# EasyEDA Pro project ProPrj_STM32F407核心板M.2_Vel1.0.epro, schematic Schematic1
Board Name: Board1; Create Date: 2025-01-26; Page Name: P1; Project Name: STM32F407核心板M.2; Schematic Name: Schematic1; Update Date: 2025-02-14; Company: 嘉立创EDA; Page Size: A4; Version: V1.0
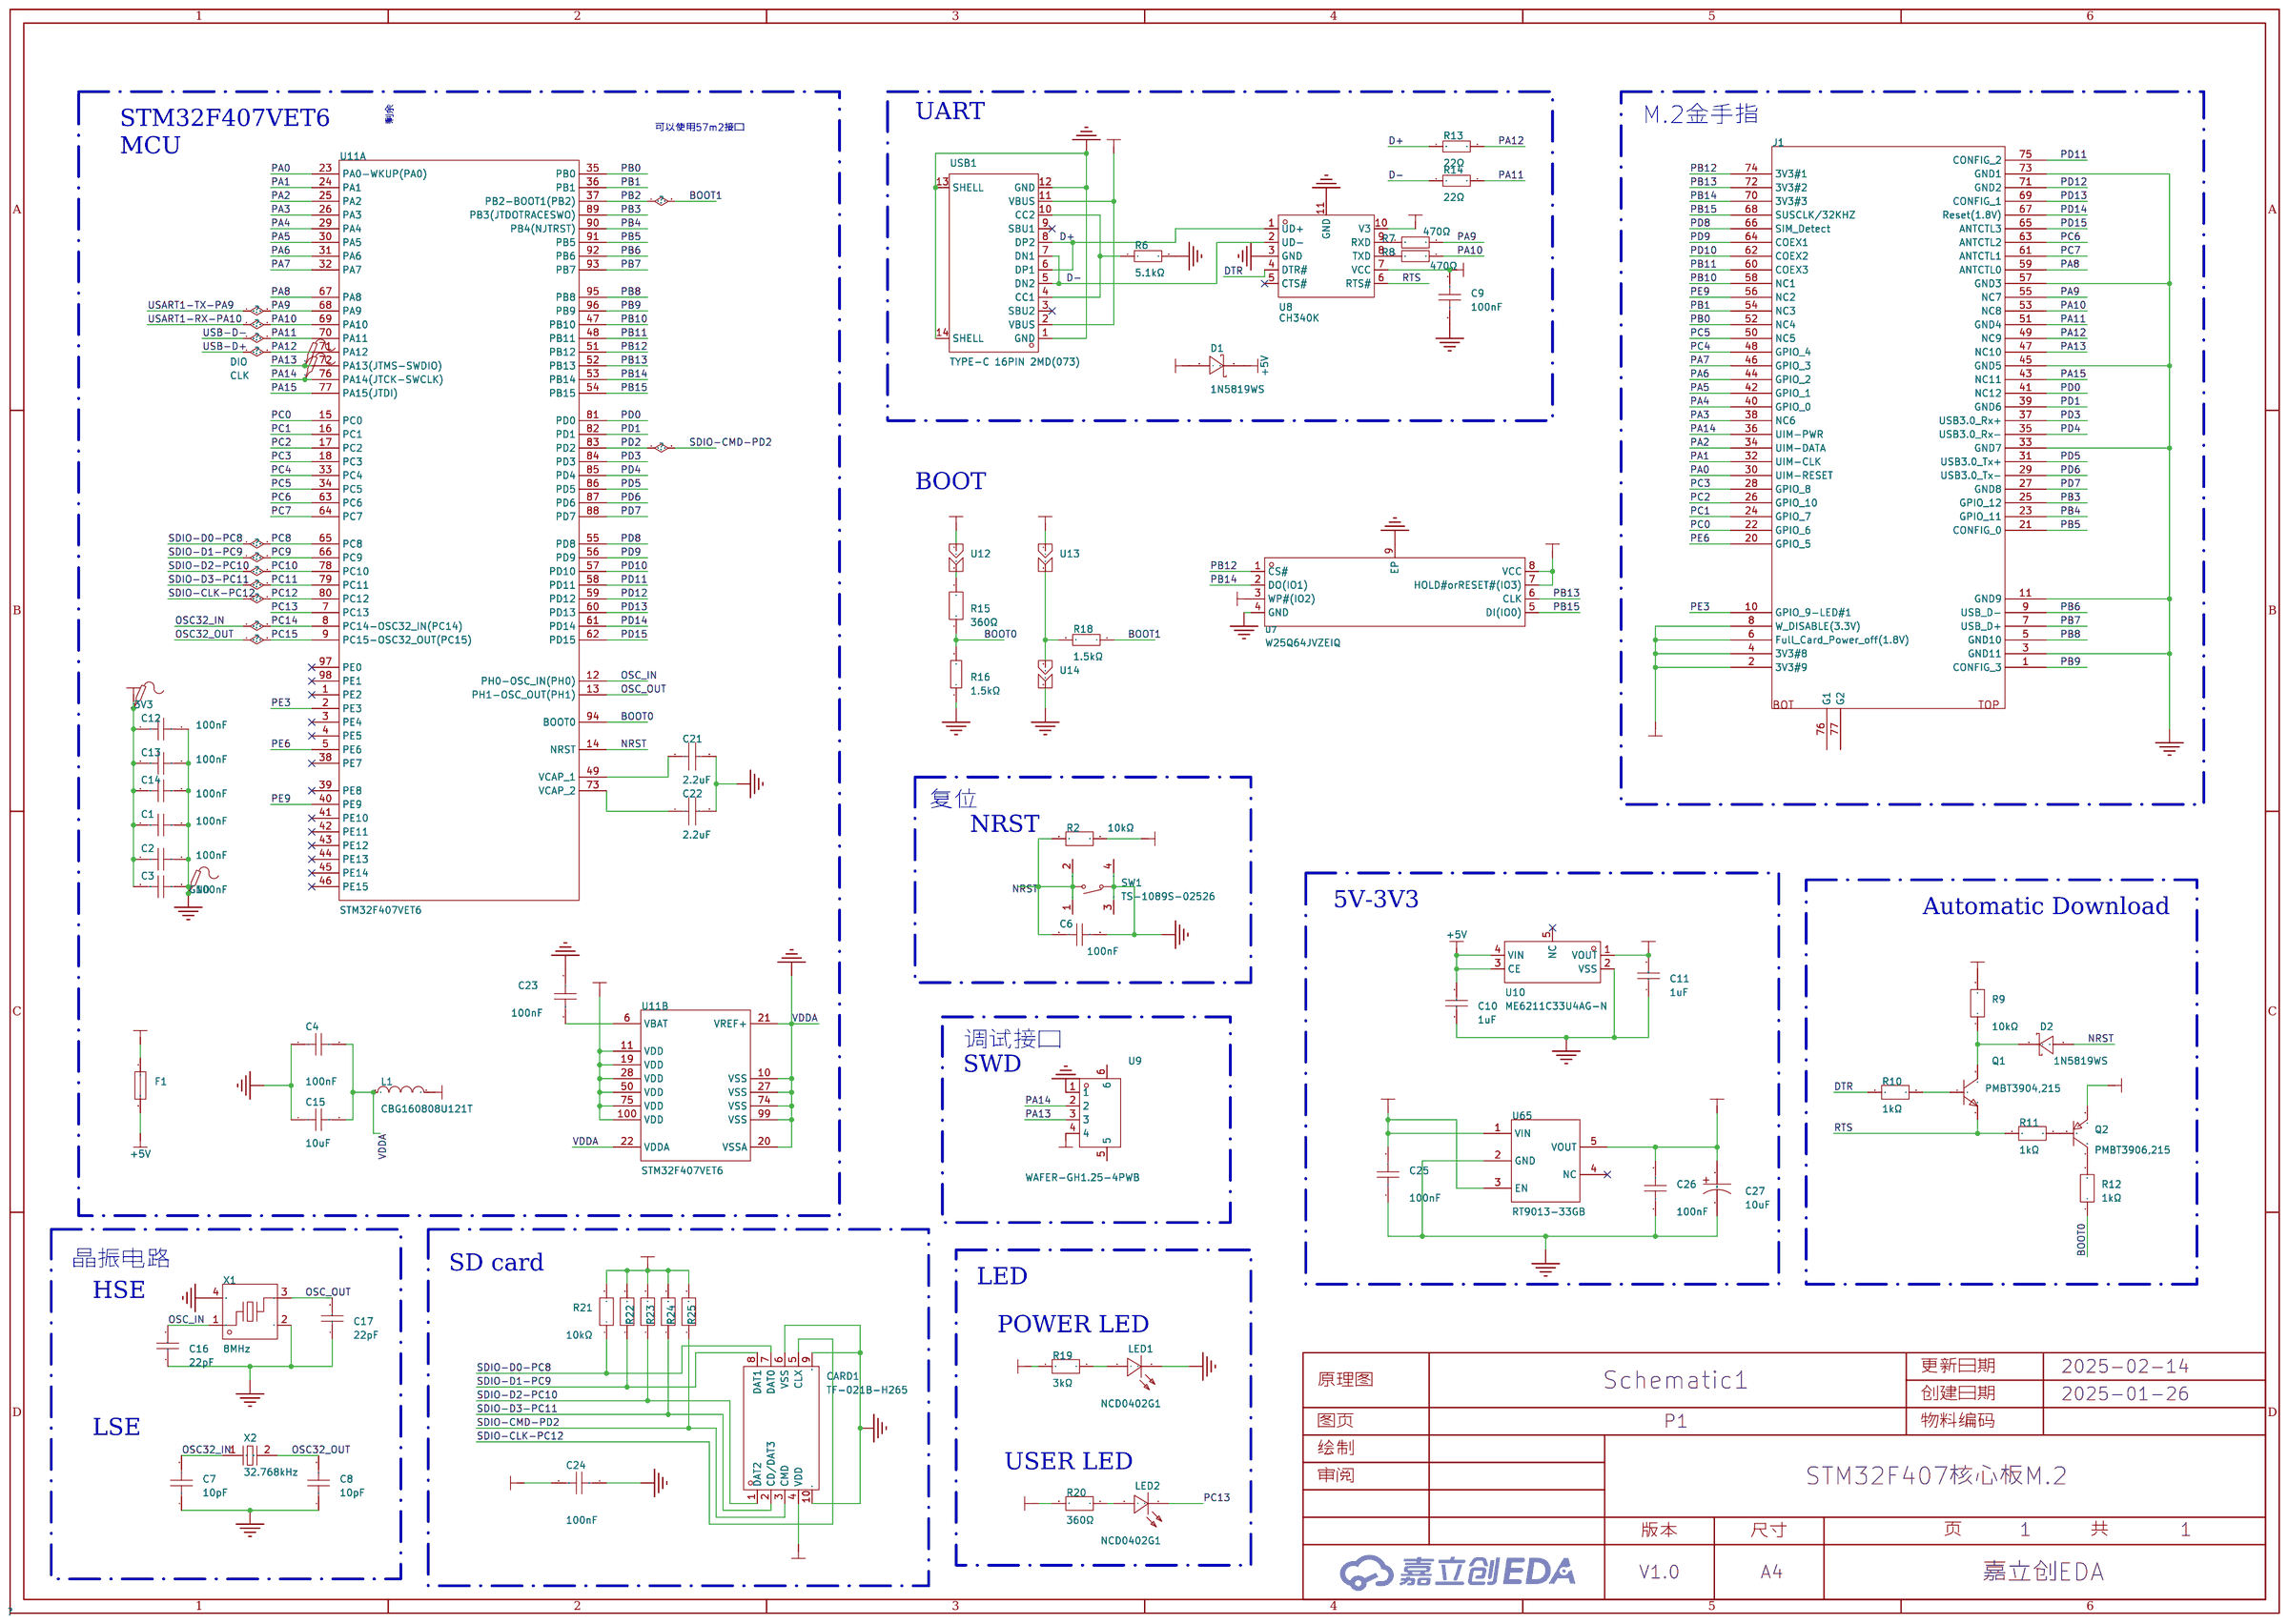
[diagram p0: schematic sheet]

## Parts
3V3  -  [Test-Point-0.5mm]
C1  100nF  [C0402]
C2  100nF  [C0402]
C3  100nF  [C0402]
C4  100nF  [C0402]
C6  100nF  [C0402]
C7  10pF  [C0402]
C8  10pF  [C0402]
C9  100nF  [C0402]
C10  1uF  [C0402]
C11  1uF  [C0402]
C12  100nF  [C0402]
C13  100nF  [C0402]
C14  100nF  [C0402]
C15  10uF  [C0402]
C16  22pF  [C0402]
C17  22pF  [C0402]
C21  2.2uF  [C0402]
C22  2.2uF  [C0402]
C23  100nF  [C0402]
C24  100nF  [C0402]
C25  100nF  [C0402]
C26  100nF  [C0402]
C27  10uF  [CAP-SMD_L3.2-W1.6]
CARD1  TF-021B-H265  [TF-SMD_TF-021B-H265]
CLK  -  [Test-Point-0.5mm]
D1  1N5819WS  [SOD-323_L1.8-W1.3-LS2.5-RD]
D2  1N5819WS  [SOD-323_L1.8-W1.3-LS2.5-RD]
DIO  -  [Test-Point-0.5mm]
F1  BSMD0603-050-6V  [F0603]
GND  -  [Test-Point-0.5mm]
J1  -  [M.2.BKey.MALE.2230]
L1  CBG160808U121T  [L0603]
LED1  NCD0402G1  [LED0402-RD]
LED2  NCD0402G1  [LED0402-RD]
Q1  PMBT3904,215  [SOT-23_L2.9-W1.3-P1.90-LS2.4-BR]
Q2  PMBT3906,215  [SOT-23-3_L2.9-W1.3-P1.90-LS2.4-BR]
R2  10kΩ  [R0402]
R6  5.1kΩ  [R0402]
R7  470Ω  [R0402]
R8  470Ω  [R0402]
R9  10kΩ  [R0402]
R10  1kΩ  [R0402]
R11  1kΩ  [R0402]
R12  1kΩ  [R0402]
R13  22Ω  [R0402]
R14  22Ω  [R0402]
R15  360Ω  [R0402]
R16  1.5kΩ  [R0402]
R18  1.5kΩ  [R0402]
R19  3kΩ  [R0402]
R20  360Ω  [R0402]
R21  10kΩ  [R0402]
R22  10kΩ  [R0402]
R23  10kΩ  [R0402]
R24  10kΩ  [R0402]
R25  10kΩ  [R0402]
SW1  TS-1089S-02526  [SW-SMD_4P-L4.2-W3.3-P2.15-LS5.1]
U7  W25Q64JVZEIQ  [WSON-8_L8.0-W6.10-P1.27-BL-EP]
U8  CH340K  [ESOP-10_L4.9-W3.9-P1.00-LS6.0-BL-EP]
U9  WAFER-GH1.25-4PWB  [CONN-SMD_4P-P1.25_XUNPU_WAFER-GH1.25-4PWB]
U10  ME6211C33U4AG-N  [FBP4L_L1.0-W1.0-P0.65-BL-EP]
U11  STM32F407VET6  [LQFP-100_L14.0-W14.0-P0.50-LS16.0-BL]  (sections 1,2)
U12  -  [JP_W1.6_H0.8]  (no BOM)
U13  -  [JP_W1.6_H0.8]  (no BOM)
U14  -  [JP_W1.6_H0.8]  (no BOM)
U65  RT9013-33GB  [SOT-23-5_L3.0-W1.7-P0.95-LS2.8-BL]
USB1  TYPE-C 16PIN 2MD(073)  [USB-C-SMD_TYPE-C-6PIN-2MD-073]
X1  8MHz  [CRYSTAL-SMD_4P-L3.2-W2.5-BL]
X2  32.768kHz  [CRYSTAL-SMD_L3.2-W1.5-1]

## Library data of the parts
3V3 CLK DIO GND = Test-Point: Test Point 测试点
C1-C4 C6 C9 C12-C14 C23-C26 = CC0402KRX7R7BB104: 容值:100nF;精度:±10%;额定电压:16V;材质(温度系数):X7R;; LCSC Part Name: 100nF ±10% 16V; Supplier Part: C60474; Manufacturer: YAGEO(国巨); Supplier Footprint: 0402; JLCPCB Part Class: 扩展库; Datasheet: https://atta.szlcsc.com/upload/public/pdf/source/20211223/9278FD768280B81DDBEF48FA36411A03.pdf; Supplier: LCSC; Tolerance: ±10%; Voltage Rated: 16V; Temperature Coefficient: X7R
C7 C8 = CC0402KRNPO7BN100: 容值:10pF;精度:±10%;额定电压:16V;材质(温度系数):NP0;; LCSC Part Name: 10pF ±10% 16V; Supplier Part: C2168196; Manufacturer: YAGEO(国巨); Supplier Footprint: 0402; JLCPCB Part Class: 扩展库; Datasheet: https://atta.szlcsc.com/upload/public/pdf/source/20210719/C2168196_0370B4F3F77A8EF596F0BE6362E3A94E.pdf; Supplier: LCSC; Tolerance: ±10%; Voltage Rated: 16V; Temperature Coefficient: NP0
C10 C11 = CL05A105KO5NNNC: 容值:1uF;精度:±10%;额定电压:16V;材质(温度系数):X5R;; LCSC Part Name: 1uF ±10% 16V; Supplier Part: C29266; Manufacturer: SAMSUNG(三星); Supplier Footprint: 0402; JLCPCB Part Class: 扩展库; Datasheet: https://atta.szlcsc.com/upload/public/pdf/source/20160218/1457707763339.pdf; Supplier: LCSC; Tolerance: ±10%; Voltage Rated: 16V; Temperature Coefficient: X5R
C15 = GRM155R61A106ME44D: 容值:10uF;精度:±20%;额定电压:10V;材质(温度系数):X5R;; LCSC Part Name: 10uF ±20% 10V; Supplier Part: C77000; Manufacturer: muRata(村田); Supplier Footprint: 0402; JLCPCB Part Class: 扩展库; Datasheet: https://atta.szlcsc.com/upload/public/pdf/source/20180530/C77000_4866797CFE3A842CD03C597EBD6AE6CD.pdf; Supplier: LCSC; Tolerance: ±20%; Voltage Rated: 10V; Temperature Coefficient: X5R
C16 C17 = CC0402JRNPO9BN220: 容值:22pF;精度:±5%;额定电压:50V;材质(温度系数):NP0;; LCSC Part Name: 22pF ±5% 50V; Supplier Part: C106203; Manufacturer: YAGEO(国巨); Supplier Footprint: 0402; JLCPCB Part Class: 扩展库; Datasheet: https://atta.szlcsc.com/upload/public/pdf/source/20170505/1493957838062.pdf; Supplier: LCSC; Tolerance: ±5%; Voltage Rated: 50V; Temperature Coefficient: NP0
C21 C22 = CL05A225MQ5NSNC: 容值:2.2uF;精度:±20%;额定电压:6.3V;材质(温度系数):X5R;; LCSC Part Name: 2.2uF ±20% 6.3V; Supplier Part: C12530; Manufacturer: SAMSUNG(三星); Supplier Footprint: 0402; JLCPCB Part Class: 基础库; Datasheet: https://atta.szlcsc.com/upload/public/pdf/source/20160218/1457707763339.pdf; Supplier: LCSC; Tolerance: ±20%; Voltage Rated: 6.3V; Temperature Coefficient: X5R
C27 = F921A106MAA: 容值:10uF;精度:±20%;额定电压:10V;等效串联电阻:4Ω@100kHz;; LCSC Part Name: 10uF ±20% 10V; Supplier Part: C395230; Manufacturer: Kyocera AVX; Supplier Footprint: CASE-A-3216; JLCPCB Part Class: 扩展库; Datasheet: https://atta.szlcsc.com/upload/public/pdf/source/20190605/C395230_2B4F9D9063C2A4817794D627E99BD158.pdf; Supplier: LCSC; Tolerance: ±20%; Rated Voltage: 10V; Equivalent Series Resistance(ESR): 4Ω@100kHz; Operating Temperature: -55℃~+125℃
CARD1 = TF-021B-H265: 卡连接方式:拔插式;卡类型:MicroSD卡(TF卡);连接器类型:卡座;本体最大高度:2.5mm;工作温度范围:-25℃~+75℃;; LCSC Part Name: 拔插式 MicroSD卡(TF卡) 卡座; Supplier Part: C498185; Manufacturer: SOFNG(硕方); Supplier Footprint: SMD; JLCPCB Part Class: 扩展库; Datasheet: https://atta.szlcsc.com/upload/public/pdf/source/20200318/C498185_790264C8C4D0E25CCBD64FEBD13A33FF.pdf; Supplier: LCSC; Card Connection Mode: 拔插式; Card Type: MicroSD卡(TF卡); Connector Type: 卡座; Maximum Body Height: 2.5mm; Operating Temperature Range: -25℃~+75℃
D1 D2 = 1N5819WS_C191023: 正向压降(Vf):600mV@1A;直流反向耐压(Vr):40V;平均整流电流(Io):1A;; LCSC Part Name: 电压:40V 电流:1A; Supplier Part: C191023; Manufacturer: Hottech(合科泰); Supplier Footprint: SOD-323; JLCPCB Part Class: 基础库; Datasheet: https://atta.szlcsc.com/upload/public/pdf/source/20220428/3CB86FD8D28D653594B4E35F9D5AEFD9.pdf; Supplier: LCSC; Forward Voltage (Vf@If): 600mV@1A; Reverse Voltage (Vr): 40V; Average Rectified Current (Io): 1A
F1 = BSMD0603-050-6V: 最大电压:6V;最大电流:40A;保持电流:500mA;跳闸电流:1A;; LCSC Part Name: 6V 500mA 0603自恢复; Supplier Part: C883095; Manufacturer: BHFUSE(佰宏); Supplier Footprint: 0603; JLCPCB Part Class: 扩展库; Datasheet: https://atta.szlcsc.com/upload/public/pdf/source/20220302/2A4AFA61964160B34367BDE2745D6217.pdf; Supplier: LCSC; Operating Voltage (Max): 6V; Current Rating (Max): 40A; Hold Current: 500mA; Trip Current: 1A; Power Dissipation: 500mW; Resistance - Initial (Ri) (Min): 100mΩ; Resistance - Post Trip (R1) (Max): 800mΩ; Maximum Time to Trip: 100ms; Operating Temperature: -40℃~+85℃
J1 = M2-B-KEY_1
L1 = CBG160808U121T: 标称阻抗@测试频率:120Ω@100MHz;误差:±25%;直流电阻(RDC):300mΩ;; LCSC Part Name: 单路 0603磁珠 阻抗120Ω@100MHz; Supplier Part: C50843; Manufacturer: FH(风华); Supplier Footprint: 0603; JLCPCB Part Class: 扩展库; Datasheet: https://atta.szlcsc.com/upload/public/pdf/source/20190129/C361667_1614D407CC98D1D3CFBD9E1F7511C14D.pdf; Supplier: LCSC; Impedance @ Frequency: 120Ω@100MHz; Tolerance: ±25%; DC Resistance: 300mΩ; Current Rating: 200mA; Circuits: 1
LED1 LED2 = NCD0402G1: 发光颜色:翠绿色;正向电压(VF):2.6V~3.6V;功率:72mW;正向电流:5mA;主波长:515nm~530nm;透镜颜色:无色透明透镜;发光强度:100mcd~270mcd;发光角度:130°;工作温度:-30℃~+85℃;; Supplier Part: C130723; Manufacturer: 国星光电; Supplier Footprint: 0402; JLCPCB Part Class: 扩展库; Datasheet: https://atta.szlcsc.com/upload/public/pdf/source/20200820/C130723_D39B4171A1B8D8D2F39C1DC521C0922A.pdf; Supplier: LCSC; Emitted Color: 翠绿色; Forward Voltage (VF): 2.6V~3.6V; Power Dissipation: 72mW; Forward Current: 5mA; Dominant Wavelength: 515nm~530nm; Lens Color: 无色透明透镜; Luminous Intensity: 100mcd~270mcd; Viewing Angle: 130°; Operating Temperature: -30℃~+85℃
Q1 = PMBT3904,215: 晶体管类型:NPN;集电极电流(Ic):200mA;集射极击穿电压(Vceo):40V;功率(Pd):250mW;直流电流增益(hFE@Ic,Vce):100@10mA,1V;; LCSC Part Name: NPN 电流:200mA 耐压:40V; Supplier Part: C8667; Manufacturer: Nexperia(安世); Supplier Footprint: SOT-23; JLCPCB Part Class: 扩展库; Datasheet: https://atta.szlcsc.com/upload/public/pdf/source/20210520/C8667_82CC4B18F957EC74ED6E8B4E120941E6.pdf; Supplier: LCSC; Transistor Type: NPN; Collector Current (Ic): 200mA; Collector-Emitter Breakdown Voltage (Vceo): 40V; Power Dissipation (Pd): 250mW; DC Current Gain (hFE@Ic,Vce): 100@10mA,1V; Transition Frequency (fT): 300MHz; Collector Cut-Off Current (Icbo): 50nA; Collector-Emitter Saturation Voltage (VCE(sat)@Ic,Ib): 300mV@50mA,5mA
Q2 = PMBT3906,215: 晶体管类型:PNP;集电极电流(Ic):200mA;集射极击穿电压(Vceo):40V;功率(Pd):250mW;直流电流增益(hFE@Ic,Vce):100@10mA,1V;; LCSC Part Name: PNP 电流:200mA 耐压:40V; Supplier Part: C8670; Manufacturer: Nexperia(安世); Supplier Footprint: SOT-23; JLCPCB Part Class: 扩展库; Datasheet: https://atta.szlcsc.com/upload/public/pdf/source/20130412/1457706600965.pdf; Supplier: LCSC; Transistor Type: PNP; Collector Current (Ic): 200mA; Collector-Emitter Breakdown Voltage (Vceo): 40V; Power Dissipation (Pd): 250mW; DC Current Gain (hFE@Ic,Vce): 100@10mA,1V; Transition Frequency (fT): 250MHz; Collector Cut-Off Current (Icbo): 50nA; Collector-Emitter Saturation Voltage (VCE(sat)@Ic,Ib): 400mV@50mA,5mA
R2 R9 R21-R25 = FRC0402J103 TS: 电阻类型:厚膜电阻;阻值:10kΩ;精度:±5%;功率:62.5mW;最大工作电压:50V;温度系数:±100ppm/℃;; LCSC Part Name: 10kΩ ±5% 62.5mW 厚膜电阻; Supplier Part: C2906885; Manufacturer: FOJAN(富捷); Supplier Footprint: 0402; JLCPCB Part Class: 扩展库; Datasheet: https://atta.szlcsc.com/upload/public/pdf/source/20211221/925EC7D7225764EE0046F22065062C87.pdf; Supplier: LCSC; Type: 厚膜电阻; Tolerance: ±5%; Power(Watts): 62.5mW; Overload Voltage (Max): 50V; Temperature Coefficient: ±100ppm/℃; Operating Temperature Range: -55℃~+155℃
R6 = 0402WGF5101TCE: 电阻类型:厚膜电阻;阻值:5.1kΩ;精度:±1%;功率:62.5mW;最大工作电压:50V;温度系数:±100ppm/℃;; LCSC Part Name: 5.1kΩ ±1% 62.5mW 厚膜电阻; Supplier Part: C25905; Manufacturer: UNI-ROYAL(厚声); Supplier Footprint: 0402; JLCPCB Part Class: 基础库; Datasheet: https://atta.szlcsc.com/upload/public/pdf/source/20200306/C422600_1E6D84923E4A46A82E41ADD87F860B5C.pdf; Supplier: LCSC; Type: 厚膜电阻; Tolerance: ±1%; Power(Watts): 62.5mW; Overload Voltage (Max): 50V; Temperature Coefficient: ±100ppm/℃; Operating Temperature Range: -55℃~+155℃
R7 R8 = 0402WGJ0471TCE: 电阻类型:厚膜电阻;阻值:470Ω;精度:±5%;功率:62.5mW;最大工作电压:50V;温度系数:±100ppm/℃;; LCSC Part Name: 470Ω ±5% 62.5mW 厚膜电阻; Supplier Part: C25167; Manufacturer: UNI-ROYAL(厚声); Supplier Footprint: 0402; JLCPCB Part Class: 扩展库; Datasheet: https://atta.szlcsc.com/upload/public/pdf/source/20200306/C422600_1E6D84923E4A46A82E41ADD87F860B5C.pdf; Supplier: LCSC; Type: 厚膜电阻; Tolerance: ±5%; Power(Watts): 62.5mW; Overload Voltage (Max): 50V; Temperature Coefficient: ±100ppm/℃; Operating Temperature Range: -55℃~+155℃
R10-R12 = FRC0402J102 TS: 电阻类型:厚膜电阻;阻值:1kΩ;精度:±5%;功率:62.5mW;最大工作电压:50V;温度系数:±100ppm/℃;; LCSC Part Name: 1kΩ ±5% 62.5mW 厚膜电阻; Supplier Part: C2906899; Manufacturer: FOJAN(富捷); Supplier Footprint: 0402; JLCPCB Part Class: 扩展库; Datasheet: https://atta.szlcsc.com/upload/public/pdf/source/20211221/925EC7D7225764EE0046F22065062C87.pdf; Supplier: LCSC; Type: 厚膜电阻; Tolerance: ±5%; Power(Watts): 62.5mW; Overload Voltage (Max): 50V; Temperature Coefficient: ±100ppm/℃; Operating Temperature Range: -55℃~+155℃
R13 R14 = 0402WGJ0220TCE: 电阻类型:厚膜电阻;阻值:22Ω;精度:±5%;功率:62.5mW;最大工作电压:50V;温度系数:±100ppm/℃;; LCSC Part Name: 22Ω ±5% 62.5mW 厚膜电阻; Supplier Part: C25152; Manufacturer: UNI-ROYAL(厚声); Supplier Footprint: 0402; JLCPCB Part Class: 扩展库; Datasheet: https://atta.szlcsc.com/upload/public/pdf/source/20200306/C422600_1E6D84923E4A46A82E41ADD87F860B5C.pdf; Supplier: LCSC; Type: 厚膜电阻; Tolerance: ±5%; Power(Watts): 62.5mW; Overload Voltage (Max): 50V; Temperature Coefficient: ±100ppm/℃; Operating Temperature Range: -55℃~+155℃
R15 R20 = ERA2AEB361X: 电阻类型:薄膜电阻;阻值:360Ω;精度:±0.1%;功率:63mW;最大工作电压:50V;温度系数:±25ppm/℃;; LCSC Part Name: 360Ω ±0.1% 63mW 薄膜电阻; Supplier Part: C445588; Manufacturer: PANASONIC(松下); Supplier Footprint: 0402; JLCPCB Part Class: 扩展库; Supplier: LCSC; Type: 薄膜电阻; Tolerance: ±0.1%; Power(Watts): 63mW; Overload Voltage (Max): 50V; Temperature Coefficient: ±25ppm/℃; Operating Temperature Range: -55℃~+155℃
R16 R18 = 0402WGF1501TCE: 电阻类型:厚膜电阻;阻值:1.5kΩ;精度:±1%;功率:62.5mW;最大工作电压:50V;温度系数:±100ppm/℃;; LCSC Part Name: 1.5kΩ ±1% 62.5mW 厚膜电阻; Supplier Part: C25867; Manufacturer: UNI-ROYAL(厚声); Supplier Footprint: 0402; JLCPCB Part Class: 基础库; Datasheet: https://atta.szlcsc.com/upload/public/pdf/source/20200306/C422600_1E6D84923E4A46A82E41ADD87F860B5C.pdf; Supplier: LCSC; Type: 厚膜电阻; Tolerance: ±1%; Power(Watts): 62.5mW; Overload Voltage (Max): 50V; Temperature Coefficient: ±100ppm/℃; Operating Temperature Range: -55℃~+155℃
R19 = FRC0402F3001TS: 电阻类型:厚膜电阻;阻值:3kΩ;精度:±1%;功率:62.5mW;最大工作电压:50V;温度系数:±100ppm/℃;; LCSC Part Name: 3kΩ ±1% 62.5mW 厚膜电阻; Supplier Part: C2909355; Manufacturer: FOJAN(富捷); Supplier Footprint: 0402; JLCPCB Part Class: 扩展库; Datasheet: https://atta.szlcsc.com/upload/public/pdf/source/20211221/925EC7D7225764EE0046F22065062C87.pdf; Supplier: LCSC; Type: 厚膜电阻; Tolerance: ±1%; Power(Watts): 62.5mW; Overload Voltage (Max): 50V; Temperature Coefficient: ±100ppm/℃; Operating Temperature Range: -55℃~+155℃
SW1 = TS-1089S-02526: 电路结构:单刀单掷;按钮形状:椭圆形按钮;安装方式:立贴;开关长度:4.2mm;开关宽度:3.25mm;开关高度:2.5mm;触点电流:50mA;额定电压(DC):12V;带灯:-;机械寿命:-;; LCSC Part Name: 4.2*3.25*2.5mm 立贴 轻触开关; Supplier Part: C455282; Manufacturer: XUNPU(讯普); Supplier Footprint: SMD,3.3x4.2mm; JLCPCB Part Class: 扩展库; Datasheet: https://atta.szlcsc.com/upload/public/pdf/source/20191118/C455282_2E86A26A9CC4FEF4662951C4D45ED672.pdf; Supplier: LCSC; Circuit: 单刀单掷; Actuator Style: 椭圆形按钮; Mounting Style: 立贴; Switch Length: 4.2mm; Switch Width: 3.25mm; Switch Height: 2.5mm; Contact Current: 50mA; Voltage Rating (DC): 12V
U7 = W25Q64JVZEIQ_C571262: Supplier Part: C571262; Manufacturer: WINBOND(华邦); Supplier Footprint: WSON-8-EP(6.1x8); JLCPCB Part Class: 扩展库; Datasheet: https://atta.szlcsc.com/upload/public/pdf/source/20200623/C571262_E4E48B163420CB751DCE7A46E02C1527.pdf; Supplier: LCSC
U8 = CH340K_C18208922: LCSC Part Name: CH340K 人工转编带; Supplier Part: C18208922; Manufacturer: WCH(南京沁恒); Supplier Footprint: ESSOP-10-150mil-1mm; JLCPCB Part Class: 扩展库; Datasheet: https://atta.szlcsc.com/upload/public/pdf/source/20240313/9D833A30DDFD16C064A7ADE10A944019.pdf; Supplier: LCSC
U9 = WAFER-GH1.25-4PWB: 插针结构:1x4P;间距:1.25mm;安装方式:卧贴;参考系列:GH;总PIN数:4P;排数:1;每排PIN数:4;额定电流:1A;工作温度范围:-25℃~+85℃;; LCSC Part Name: 1x4P 间距:1.25mm 卧贴 系列:GH; Supplier Part: C3029379; Manufacturer: XUNPU(讯普); Supplier Footprint: SMD,P=1.25mm,卧贴; JLCPCB Part Class: 扩展库; Datasheet: https://atta.szlcsc.com/upload/public/pdf/source/20220527/CB8773BFB0913C3B8ABD62CB38BA101A.pdf; Supplier: LCSC; Pins Structure: 1x4P; Pitch: 1.25mm; Mounting Style: 卧贴; Reference Series: GH; Number of Pins: 4P; Number of Rows: 1; Number of PINs Per Row: 4; Current Rating (Max): 1A; Operating Temperature Range: -25℃~+85℃
U10 = ME6211C33U4AG-N: 输出类型:-;; Supplier Part: C428904; Manufacturer: MICRONE(南京微盟); Supplier Footprint: X2-SON-4-EP(1x1); JLCPCB Part Class: 扩展库; Datasheet: https://atta.szlcsc.com/upload/public/pdf/source/20200508/C428904_D454FD5FAEB1C5C5106F0E7106983591.pdf; Supplier: LCSC
U11 = STM32F407VET6: CPU内核:ARM-M4;CPU最大主频:168MHz;应用领域:-;; LCSC Part Name: 带DSP和FPU的高性能基础系列ARM Cortex-M4 MCU，具有512 KB Flash、168 MHz CPU、ART加速器、以太网和FSMC; Supplier Part: C28730; Manufacturer: ST(意法半导体); Supplier Footprint: LQFP-100(14x14); JLCPCB Part Class: Extended Part; Datasheet: https://atta.szlcsc.com/upload/public/pdf/source/20140801/1457707197138.pdf; Supplier: LCSC; CPU Core: ARM-M4; CPU Maximum Speed: 168MHz; Program Storage Size: 512KB; Program Memory Type: FLASH; Number of I/O: 82; ADC (Bit): 12bit; DAC (Bit): 12bit; Low Voltage Detection Threshold: 1.8V~3.6V
U12-U14 = JP: Jumper 2p
U65 = RT9013-33GB: 输出类型:固定;最大输入电压:5.5V;输出电压:3.3V;输出电流:500mA;电源纹波抑制比(PSRR):50dB@(10kHz);输出极性:正极;; LCSC Part Name: 输入5.5V 输出3.3V 500mA; Supplier Part: C47773; Manufacturer: RICHTEK(立锜); Supplier Footprint: SOT-23-5; JLCPCB Part Class: 扩展库; Datasheet: https://atta.szlcsc.com/upload/public/pdf/source/20150504/1457707282459.pdf; Supplier: LCSC; Output Type: 固定; Maximum Input Voltage: 5.5V; Output Voltage: 3.3V; Output Current: 500mA; Power Supply Rejection Ratio (PSRR): 50dB@(10kHz); Dropout Voltage: 400mV@(500mA); standby current: 50uA; Feature: 低ESR；防静电保护；热保护(TSD)；过流保护(OCP)；带使能; Operating Temperature: -40℃~+85℃; Output Polarity: 正极; Number of Outputs: 1
USB1 = TYPE-C 16PIN 2MD(073): 连接器类型:Type-C;标准:-;公母:母;端口数量:1;触点数量:16P;安装方式:卧贴;额定电流 - 电源:5A;工作温度范围:-25℃~+85℃;; LCSC Part Name: Type-C 母 卧贴; Supplier Part: C2765186; Manufacturer: SHOU HAN(首韩); Supplier Footprint: SMD; JLCPCB Part Class: 扩展库; Datasheet: https://atta.szlcsc.com/upload/public/pdf/source/20211123/39B17C16241EAC15C5E277BDA434118E.pdf; Supplier: LCSC; Connector Type: Type-C; Gender: 母; Number of Ports: 1; Number of Contacts: 16P; Mounting Style: 卧贴; Current Rating - Power (Max): 5A; Operating Temperature Range: -25℃~+85℃
X1 = TAXM8M4RLBDDT2T: 晶振类型:贴片晶振;频率:8MHz;常温频差:±10ppm;外接负载电容:20pF;频率稳定度(全温):±20ppm;; LCSC Part Name: 8MHz ±10ppm 20pF; Supplier Part: C720915; Manufacturer: YJX(雅晶鑫); Supplier Footprint: SMD3225-4P; JLCPCB Part Class: 扩展库; Datasheet: https://atta.szlcsc.com/upload/public/pdf/source/20210712/C720915_45D1BC3FB7DF3C2613CC0C56A3617E06.pdf; Supplier: LCSC; Crystal Type: 贴片晶振; Normal temperature Frequency Tolerance: ±10ppm; External load capacitor: 20pF; Frequency Stability(Full temperature range): ±20ppm; Equivalent Series Resistance (ESR): 250Ω; Operating Temperature: -30℃~+85℃
X2 = FC-135 32.7680KA-AG5: 晶振类型:贴片晶振;频率:32.768kHz;常温频差:±20ppm;外接负载电容:7pF;; LCSC Part Name: 32.768kHz ±20ppm 7pF; Supplier Part: C440693; Manufacturer: EPSON(爱普生); Supplier Footprint: SMD3215-2P; JLCPCB Part Class: 扩展库; Datasheet: https://atta.szlcsc.com/upload/public/pdf/source/20230606/9F54EAFA52F692581482D26E2391AEA1.pdf; Supplier: LCSC; Crystal Type: 贴片晶振; Normal temperature Frequency Tolerance: ±20ppm; External load capacitor: 7pF; Equivalent Series Resistance (ESR): 70kΩ; Operating Temperature: -40℃~+85℃

## Nets
3V3: 3V3.1 C1.1 C2.1 C3.1 C9.2 C11.2 C12.1 C13.1 C14.1 C24.2 C26.2 C27.1 CARD1.4(VDD) L1.2 Q2.2(E) R2.2 R9.2 R19.1 R20.2 R21.2 R22.2 R23.2 R24.2 R25.2 U7.3(WP#(IO2)) U7.7(HOLD#orRESET#(IO3)) U7.8(VCC) U8.7(VCC) U8.10(V3) U9.4 U10.1(VOUT) U11.11(VDD) U11.19(VDD) U11.28(VDD) U11.50(VDD) U11.75(VDD) U11.100(VDD) U12.1 U13.1 U65.5(VOUT)
+5V: C10.2 C25.2 D1.1(K) F1.2 U10.3(CE) U10.4(VIN) U65.1(VIN) U65.3(EN)
GND: C1.2 C2.2 C3.2 C4.1 C6.2 C7.1 C8.1 C9.1 C10.1 C11.1 C12.2 C13.2 C14.2 C15.1 C16.1 C17.1 C21.2 C22.2 C23.1 C24.1 C25.1 C26.1 C27.2 CARD1.6(VSS) CARD1.9 CARD1.10 GND.1 J1.3(GND11) J1.11(GND9) J1.33(GND7) J1.45(GND5) J1.57(GND3) J1.73(GND1) LED1.1(K) R6.2 R16.1 SW1.3 SW1.4 U7.4(GND) U7.9(EP) U8.3(GND) U8.11(GND) U9.1 U10.2(VSS) U11.10(VSS) U11.20(VSSA) U11.27(VSS) U11.74(VSS) U11.99(VSS) U14.2 U65.2(GND) USB1.1(GND) USB1.12(GND) USB1.13(SHELL) USB1.14(SHELL) X1.2(GND) X1.4(GND)
VCC_USB: D1.2(A) USB1.2(VBUS) USB1.11(VBUS)
VDDA: C4.2 C15.2 L1.1 U11.21(VREF+) U11.22(VDDA)
BOOT0: R12.1 R15.1 R16.2 U11.94(BOOT0)
BOOT1: R18.1 U11.37(PB2-BOOT1(PB2))
D+: R13.1 U8.1(UD+) USB1.6(DP1) USB1.8(DP2)
D-: R14.1 U8.2(UD-) USB1.5(DN2) USB1.7(DN1)
DTR: R10.1 U8.4(DTR#)
M2_IN_+5V: F1.1 J1.2(3V3#9) J1.4(3V3#8) J1.6(Full_Card_Power_off(1.8V)) J1.8(W_DISABLE(3.3V))
NRST: C6.1 D2.2(A) R2.1 SW1.1 SW1.2 U11.14(NRST)
OSC32_IN: C7.2 U11.8(PC14-OSC32_IN(PC14)) X2.1
OSC32_OUT: C8.2 U11.9(PC15-OSC32_OUT(PC15)) X2.2(GND)
OSC_IN: C16.2 U11.12(PH0-OSC_IN(PH0)) X1.1
OSC_OUT: C17.2 U11.13(PH1-OSC_OUT(PH1)) X1.3
PA0: J1.30(UIM-RESET) U11.23(PA0-WKUP(PA0))
PA1: J1.32(UIM-CLK) U11.24(PA1)
PA2: J1.34(UIM-DATA) U11.25(PA2)
PA3: J1.38(NC6) U11.26(PA3)
PA4: J1.40(GPIO_0) U11.29(PA4)
PA5: J1.42(GPIO_1) U11.30(PA5)
PA6: J1.44(GPIO_2) U11.31(PA6)
PA7: J1.46(GPIO_3) U11.32(PA7)
PA8: J1.59(ANTCTL0) U11.67(PA8)
PA9: J1.55(NC7) R7.2 U11.68(PA9)
PA10: J1.53(NC8) R8.2 U11.69(PA10)
PA11: J1.51(GND4) R14.2 U11.70(PA11)
PA12: J1.49(NC9) R13.2 U11.71(PA12)
PA13: DIO.1 J1.47(NC10) U9.3 U11.72(PA13(JTMS-SWDIO))
PA14: CLK.1 J1.36(UIM-PWR) U9.2 U11.76(PA14(JTCK-SWCLK))
PA15: J1.43(NC11) U11.77(PA15(JTDI))
PB0: J1.52(NC4) U11.35(PB0)
PB1: J1.54(NC3) U11.36(PB1)
PB3: J1.25(GPIO_12) U11.89(PB3(JTDOTRACESWO))
PB4: J1.23(GPIO_11) U11.90(PB4(NJTRST))
PB5: J1.21(CONFIG_0) U11.91(PB5)
PB6: J1.9(USB_D-) U11.92(PB6)
PB7: J1.7(USB_D+) U11.93(PB7)
PB8: J1.5(GND10) U11.95(PB8)
PB9: J1.1(CONFIG_3) U11.96(PB9)
PB10: J1.58(NC1) U11.47(PB10)
PB11: J1.60(COEX3) U11.48(PB11)
PB12: J1.74(3V3#1) U7.1(CS#) U11.51(PB12)
PB13: J1.72(3V3#2) U7.6(CLK) U11.52(PB13)
PB14: J1.70(3V3#3) U7.2(DO(IO1)) U11.53(PB14)
PB15: J1.68(SUSCLK/32KHZ) U7.5(DI(IO0)) U11.54(PB15)
PC0: J1.22(GPIO_6) U11.15(PC0)
PC1: J1.24(GPIO_7) U11.16(PC1)
PC2: J1.26(GPIO_10) U11.17(PC2)
PC3: J1.28(GPIO_8) U11.18(PC3)
PC4: J1.48(GPIO_4) U11.33(PC4)
PC5: J1.50(NC5) U11.34(PC5)
PC6: J1.63(ANTCTL2) U11.63(PC6)
PC7: J1.61(ANTCTL1) U11.64(PC7)
PC8: CARD1.7(DAT0) R21.1 U11.65(PC8)
PC9: CARD1.8(DAT1) R22.1 U11.66(PC9)
PC10: CARD1.1(DAT2) R23.1 U11.78(PC10)
PC11: CARD1.2(CD/DAT3) R24.1 U11.79(PC11)
PC12: CARD1.5(CLX) U11.80(PC12)
PC13: LED2.1(K) U11.7(PC13)
PD0: J1.41(NC12) U11.81(PD0)
PD1: J1.39(GND6) U11.82(PD1)
PD2: CARD1.3(CMD) R25.1 U11.83(PD2)
PD3: J1.37(USB3.0_Rx+) U11.84(PD3)
PD4: J1.35(USB3.0_Rx-) U11.85(PD4)
PD5: J1.31(USB3.0_Tx+) U11.86(PD5)
PD6: J1.29(USB3.0_Tx-) U11.87(PD6)
PD7: J1.27(GND8) U11.88(PD7)
PD8: J1.66(SIM Detect) U11.55(PD8)
PD9: J1.64(COEX1) U11.56(PD9)
PD10: J1.62(COEX2) U11.57(PD10)
PD11: J1.75(CONFIG_2) U11.58(PD11)
PD12: J1.71(GND2) U11.59(PD12)
PD13: J1.69(CONFIG_1) U11.60(PD13)
PD14: J1.67(Reset(1.8V)) U11.61(PD14)
PD15: J1.65(ANTCTL3) U11.62(PD15)
PE3: J1.10(GPIO_9-LED#1) U11.2(PE3)
PE6: J1.20(GPIO_5) U11.5(PE6)
PE9: J1.56(NC2) U11.40(PE9)
RTS: Q1.2 R11.1 U8.6(RTS#)
$1N16193: R15.2 U12.2
$1N16597: R18.2 U13.2 U14.1
$1N16719: LED1.2(A) R19.2
$1N16929: LED2.2(A) R20.1
$1N18159: C21.1 U11.49(VCAP_1)
$1N18195: C22.1 U11.73(VCAP_2)
$1N18531: C23.2 U11.6(VBAT)
Net-(D2-1): D2.1(K) Q1.3 R9.1
Net-(Q1-1): Q1.1 R10.2
Net-(Q2-1): Q2.1(B) R11.2
Net-(Q2-3): Q2.3(C) R12.2
Net-(R6-1): R6.1 USB1.4(CC1) USB1.10(CC2)
Net-(R7-1): R7.1 U8.9(RXD)
Net-(R8-1): R8.1 U8.8(TXD)

Not connected (* = marked no-connect by the designer): J1 76(G1) 77(G2); U8 5(CTS#)*; U9 5 6; U10 5(NC)*; U11 1(PE2)* 3(PE4)* 4(PE5)* 38(PE7)* 39(PE8)* 41(PE10)* 42(PE11)* 43(PE12)* 44(PE13)* 45(PE14)* 46(PE15)* 97(PE0)* 98(PE1)*; U65 4(NC)*; USB1 3(SBU2)* 9(SBU1)*

## Notes on the sheet
- 剩余
- UART
- M.2金手指
- STM32F407VET6
- 可以使用57m2接口
- MCU
- BOOT
- 复位
- NRST
- 5V-3V3
- Automatic Download
- 调试接口
- SWD
- 晶振电路
- SD card
- LED
- HSE
- POWER LED
- LSE
- USER LED
